# EAGLE design Adafruit DRV8833 (EAGLE 6.6.0)
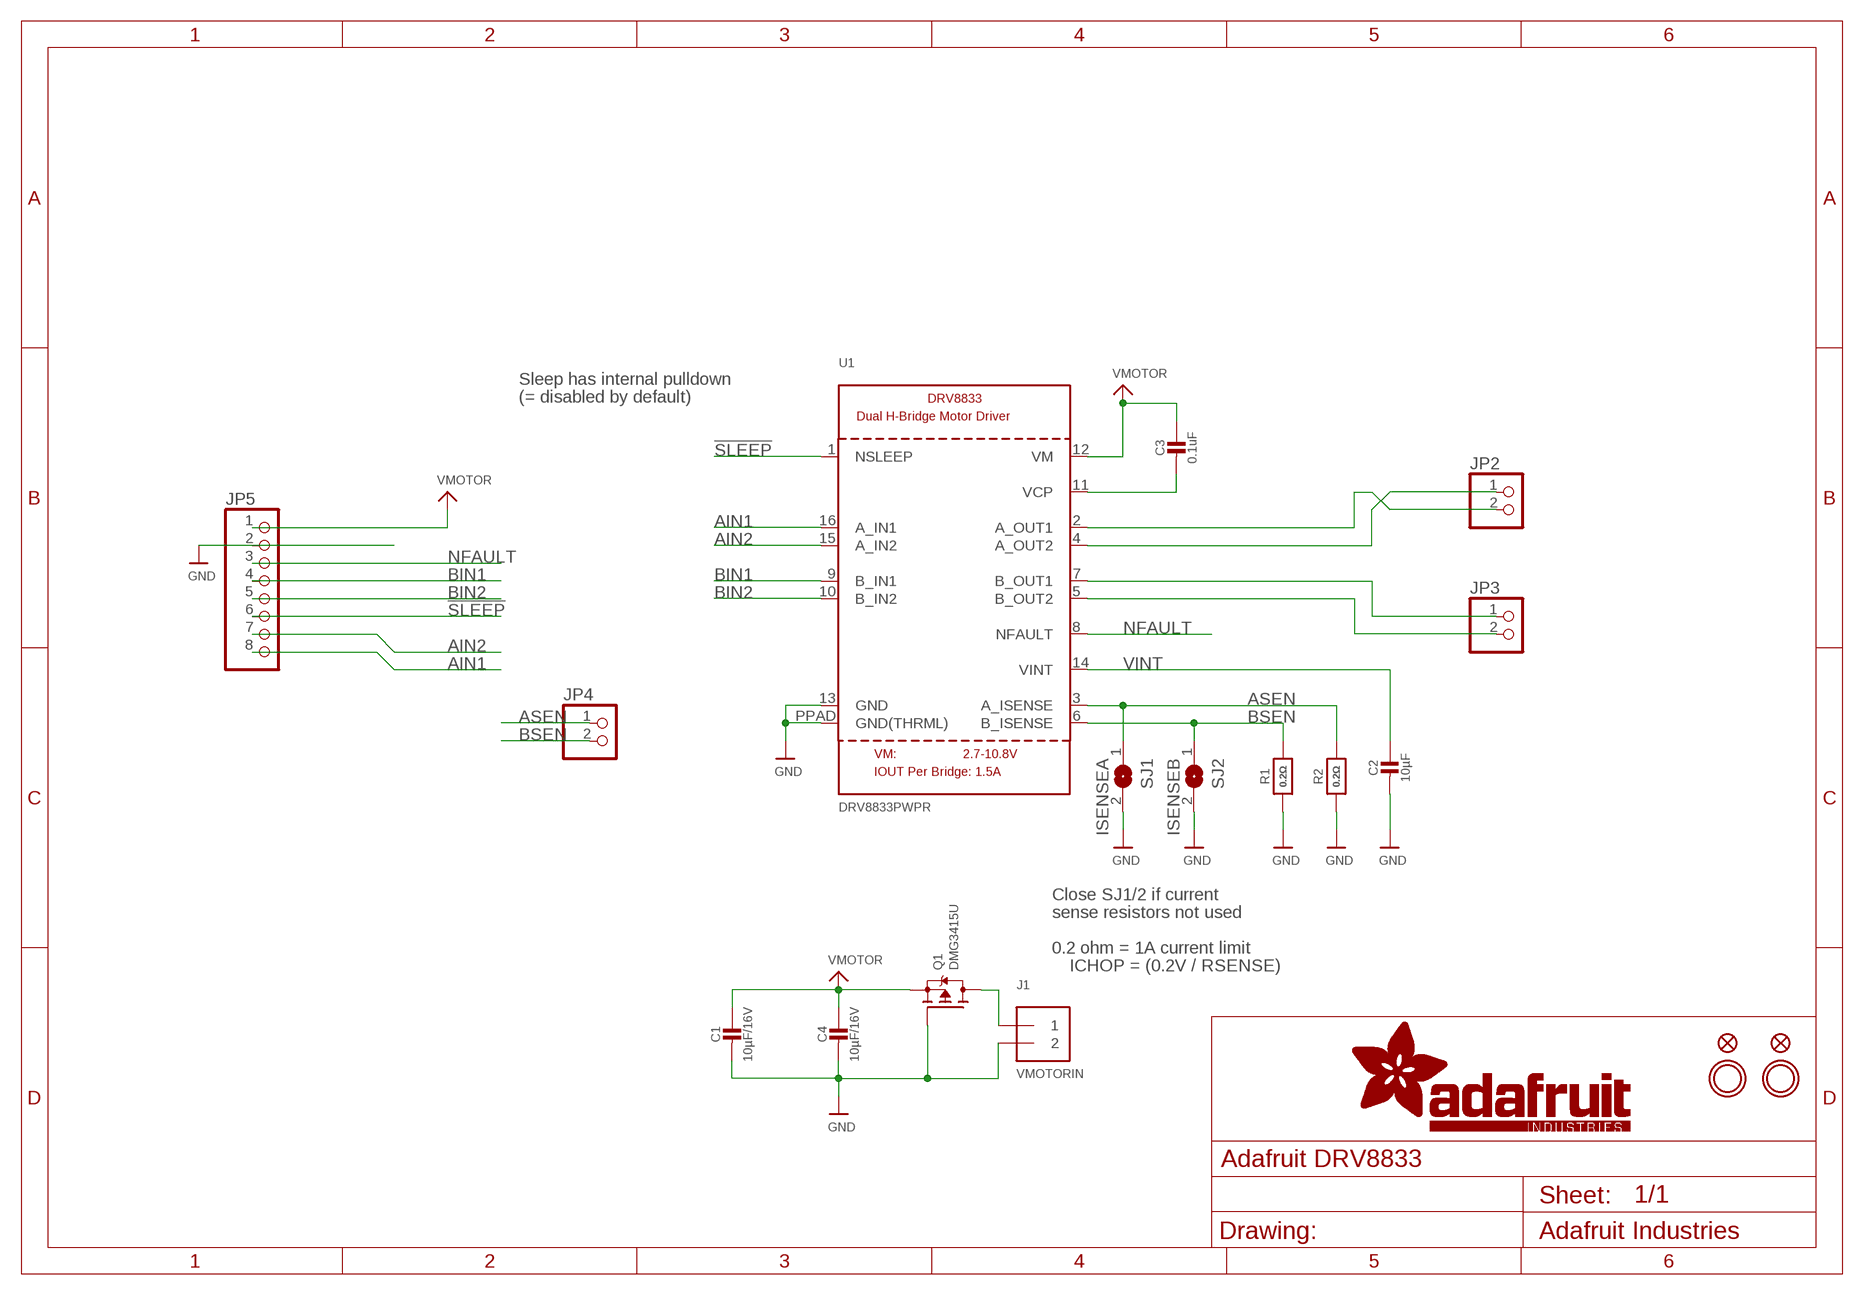
[diagram p0: schematic, sheet 1]

## Parts
C1  10µF/16V  CAP_CERAMIC0805-NOOUTLINE  [0805-NO]
C2  10µF  CAP_CERAMIC0805-NOOUTLINE  [0805-NO]
C3  0.1uF  CAP_CERAMIC0805-NOOUTLINE  [0805-NO]
C4  10µF/16V  CAP_CERAMIC0805-NOOUTLINE  [0805-NO]
FID1  FIDUCIAL""  [FIDUCIAL_1MM]
FID2  FIDUCIAL""  [FIDUCIAL_1MM]
J1  VMOTORIN  TERMBLOCK_1X2  [TERMBLOCK_1X2-3.5MM]
JP2  HEADER-1X2ROUND  [1X02_ROUND]
JP3  HEADER-1X2ROUND  [1X02_ROUND]
JP4  HEADER-1X2ROUND  [1X02_ROUND]
JP5  HEADER-1X870MIL  [1X08_ROUND_70]
Q1  DMG3415U  MOSFET-PWIDE  [SOT23-WIDE]
R1  0.2Ω  RESISTOR_1206  [_1206]
R2  0.2Ω  RESISTOR_1206  [_1206]
SJ1  ISENSEA  SOLDERJUMPER  [SOLDERJUMPER_ARROW_NOPASTE]
SJ2  ISENSEB  SOLDERJUMPER  [SOLDERJUMPER_ARROW_NOPASTE]
U1  DRV8833PWPR  DRV8833  [HTSSOP16]
U$13  MOUNTINGHOLE2.5  [MOUNTINGHOLE_2.5_PLATED]
U$14  MOUNTINGHOLE2.5  [MOUNTINGHOLE_2.5_PLATED]

## Nets
!SLEEP: JP5.6 U1.1(NSLEEP)
AIN1: JP5.8 U1.16(A_IN1)
AIN2: JP5.7 U1.15(A_IN2)
AOUT1: JP2.2 U1.2(A_OUT1)
AOUT2: JP2.1 U1.4(A_OUT2)
ASEN: JP4.1 R2.2 SJ1.1 U1.3(A_ISENSE)
BIN1: JP5.4 U1.9(B_IN1)
BIN2: JP5.5 U1.10(B_IN2)
BOUT1: JP3.1 U1.7(B_OUT1)
BOUT2: JP3.2 U1.5(B_OUT2)
BSEN: JP4.2 R1.2 SJ2.1 U1.6(B_ISENSE)
GND: C1.2 C2.2 C4.2 J1.2 JP5.2 Q1.1(G) R1.1 R2.1 SJ1.2 SJ2.2 U1.13(GND) U1.PPAD(GND(THRML))
N$8: C3.2 U1.11(VCP)
NFAULT: JP5.3 U1.8(NFAULT)
PWRIN: J1.1 Q1.3(D)
VINT: C2.1 U1.14(VINT)
VMOTOR: C1.1 C3.1 C4.1 JP5.1 Q1.2(S) U1.12(VM)

## Notes on the sheet
- Sleep has internal pulldown
- (= disabled by default)
- Close SJ1/2 if current
- sense resistors not used
- 0.2 ohm = 1A current limit
- ICHOP = (0.2V / RSENSE)

## Library data of the parts
C1-C4 = microbuilder:CAP_CERAMIC: Ceramic Capacitors For new designs, use the packages preceded by an '_' character since they are more reliable: The following footprints should be used on most boards: _0402 - Standard footprint for regular board layouts _0603 - Standard footprint for regular board layouts _0805 - Standard footprint for regular board layouts _1206 - Standard footprint for regular board layouts For extremely tight-pitch boards where space is at a premium, the following 'micro-pitch' footprints can be used (smaller pads, no silkscreen outline, etc.): _0402MP - Micro-pitch footprint for very dense/compact boards _0603MP - Micro-pitch footprint for very dense/compact boards _0805MP - Micro-pitch footprint for very dense/compact boards _1206MP - Micro-pitch footprint for very dense/compact boards
FID1 FID2 = microbuilder:FIDUCIAL: Fiducial Alignment Points Various fiducial points for machine vision alignment.; BOM: EXCLUDE
J1 = microbuilder:TERMBLOCK_1X2: 3.5mm Terminal block http://www.ladyada.net/library/pcb/eaglelibrary.html
JP2-JP4 = microbuilder:HEADER-1X2: PIN HEADER
JP5 = microbuilder:HEADER-1X8: PIN HEADER
Q1 = microbuilder:MOSFET-P: P-Channel Mosfet LEGEND VDS: Voltage Drain-Source ID: Drain Current RDS(ON): Drain-Source On-State Resistance VGS(TH): Gate-Source Threshold Voltage CISS: Drain-Source Input Capacitance SOT-23 Name VDS ID RDS(ON) VGS(TH) CISS Order Number IRLML5103 30V 760mA 600 mOhm -- 75pF @ 25V Digikey: IRLML5103PBFCT-ND IRLML6401 12V 4.3A 50 mOhm 950mV @ 250µA 830pF @ 10V Digikey: IRLML6401PBFTR-ND NTR0202PL 20V 400mA 800 mOhm 2.3V @ 250uA 70pF @ 5V Digikey: NTR0202PLT1GOSTR-ND NTR4101PT1G 20V 1.8A 85 mOhm 1.2V @ 250uA 675pF @ 10V Digikey: NTR4101PT1GOSCT-ND DMP2004K 20V 600mA 900 mOhm 1V @ 250uA 175pF @ 16V Digikey: DMP2004KDICT-ND PMV65XP 20V 3.9A 76 mOhm 950mV @ 1mA 725pF @ 20V Digikey: 568-2358-2-ND TO-252 Name VDS ID RDS(ON) VGS(TH) CISS Order Number AOD417 30V 25A 34 mOhm 3V @ 250µA 920pF @ 15V Digikey: 785-1106-2-ND
R1 R2 = microbuilder:RESISTOR: Resistors For new designs, use the packages preceded by an '_' character since they are more reliable: The following footprints should be used on most boards: _0402 - Standard footprint for regular board layouts _0603 - Standard footprint for regular board layouts _0805 - Standard footprint for regular board layouts _1206 - Standard footprint for regular board layouts For extremely tight-pitch boards where space is at a premium, the following 'micro-pitch' footprints can be used (smaller pads, no silkscreen outline, etc.): _0402MP - Micro-pitch footprint for very dense/compact boards _0603MP - Micro-pitch footprint for very dense/compact boards _0805MP - Micro-pitch footprint for very dense/compact boards _1206MP - Micro-pitch footprint for very dense/compact boards
SJ1 SJ2 = microbuilder:SOLDERJUMPER: SMD Solder JUMPER Solder the two pads together to create a connection, or remove the solder to break it. REFLOW - Use this footprint for solder paste and reflow ovens. WAVE - Use this footprint for hand-soldering (larger pads). CLOSED - Has a trace between the two pads to ensure it is closed by default. The trace needs to be cut to disable the jumper, and can be closed again by creating a solder bridge between the two pads.; BOM: EXCLUDE
U1 = microbuilder:DRV8833: DRV8833 Dual H-Bridge Motor Driver -- HTSSOP Package
U$13 U$14 = microbuilder:MOUNTINGHOLE: Mounting Hole For #2 screws (0.086"/2.18mm width, 0.094"/2.4mm hole) use 2.5mm; BOM: EXCLUDE

## Board
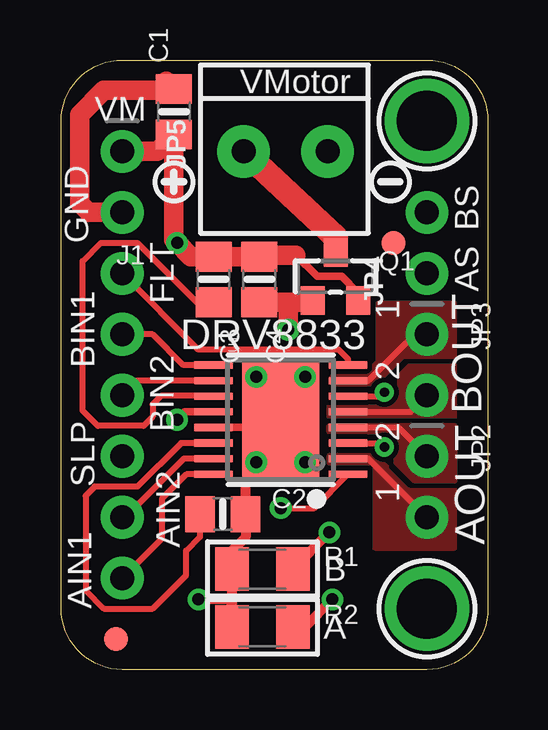
[diagram p1: board, top side]
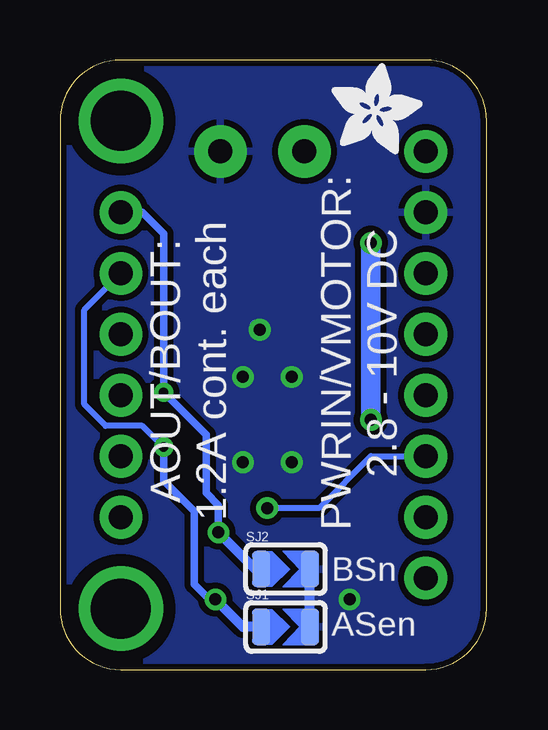
[diagram p2: board, bottom side, seen from below]

Size 17.78 x 25.4 mm. Coordinates in mm from the lower left corner, seen from the top.
Outline: 2.54,25.4 15.24,25.4 arc-90 17.78,22.86 17.78,2.54 arc-90 15.24,0 2.54,0 arc-90 0,2.54 0,22.86 arc-90 2.54,25.4
Copper layers (1*16): Top 0.035mm / dielectric 1.5mm / Bottom 0.035mm
Design rules "adafruit *": minimum track width 8mil, minimum drill 15.5mil, track to track 8mil, track to pad 8mil, pad to pad 8mil, via to via 8mil, smd to smd 8mil, copper to edge 10mil, drill to drill 8mil, minimum pad ring 10mil, minimum via ring 8mil, stop-mask expansion 2mil, vias tented up to drill 20mil, thermal gap 10mil

### Footprints (pad centres in the part's own frame; a part is rotated, then mirrored left to right if it is on the bottom)
0805-NO = smd 1.24 x 1.5: 1 -0.95,0; 2 0.95,0
FIDUCIAL_1MM = smd 1 x 1: 1 0,0
TERMBLOCK_1X2-3.5MM = drill 1 pad 2.184: 1 1.8,0; 2 -1.7,0
1X02_ROUND = drill 1 pad 1.778: 1 -1.27,0; 2 1.27,0
1X08_ROUND_70 = drill 1 pad 1.778: 1 -8.89,0; 2 -6.35,0; 3 -3.81,0; 4 -1.27,0; 5 1.27,0; 6 3.81,0; 7 6.35,0; 8 8.89,0
SOT23-WIDE = smd 1 x 1.2: 1 -0.95,-1; 2 0.95,-1; 3 0,1
_1206 = smd 1.4 x 1.8: 1 -1.27,0; 2 1.27,0
SOLDERJUMPER_ARROW_NOPASTE = smd 0.762 x 1.524: 1 -1.016,0; 2 1.016,0
HTSSOP16 = smd 0.3 x 1.6: 1 -2.275,-2.8; 2 -1.625,-2.8; 3 -0.975,-2.8; 4 -0.325,-2.8; 5 0.325,-2.8; 6 0.975,-2.8; 7 1.625,-2.8; 8 2.275,-2.8; 9 2.275,2.8; 10 1.625,2.8; 11 0.975,2.8; 12 0.325,2.8; 13 -0.325,2.8; 14 -0.975,2.8; 15 -1.625,2.8; 16 -2.275,2.8 | smd 4.8 x 3.2: PPAD 0,0
MOUNTINGHOLE_2.5_PLATED = drill 2.5 pad 3.2: P$1 0,0

### Placement (x,y rotation side)
C1  4.7,23.24 90 top
C2  6.73,6.48 0 top
C3  6.35,16.26 270 top
C4  8.26,16.26 270 top
FID1  13.84,17.78 0 top
FID2  2.29,1.27 0 top
J1  9.4,21.59 180 top
JP2  15.24,7.62 270 top
JP3  15.24,12.7 270 top
JP4  15.24,17.78 90 top
JP5  2.54,12.7 270 top
Q1  11.43,16.38 0 top
R1  8.38,4.19 0 top
R2  8.38,1.78 0 top
SJ1  8.38,1.78 0 bottom
SJ2  8.38,4.19 0 bottom
U1  9.14,10.41 90 top
U$13  15.24,22.86 0 top
U$14  15.24,2.54 0 top
U$15  [SYMBOL_PLUS]  4.7,20.32 0 top
U$16  [SYMBOL_MINUS]  13.72,20.32 0 top
U$17  [ADAFRUIT_3.5MM]  6.48,21.46 0 bottom

### Tracks (layer width: path | path; a pad name or v marks a point on that pad's centre or on a via)
!SLEEP  (via drill 0.5)
  Top 0.254: v9.14,6.73 10.54,6.73 U1.1
  Bottom 0.254: v9.14,6.73 6.98,6.73 4.83,8.89 JP5.6
AIN1
  Top 0.254: U1.16 5.22,8.14 4.19,7.11 4.19,5.46 JP5.8
AIN2
  Top 0.254: U1.15 5.11,8.79 2.67,6.35 JP5.7
AOUT1
  Top 0.254: U1.2 12.8,8.79 JP2.2
  pour Top (rank 2, no thermals): 11.18,8.89 11.18,8.64 13.08,8.64 13.08,5.08 16.38,5.08 16.38,7.62 14.61,7.62 12.95,8.89
AOUT2
  Top 0.254: U1.4 14.04,10.09 JP2.1
  pour Top (no thermals): 11.18,10.16 16.38,10.16 16.38,7.87 14.73,7.87 13.97,8.64 13.97,9.78 13.84,9.91 11.18,9.91
ASEN  (via drill 0.39, 0.5)
  Top 0.254: U1.3 13.29,9.44 v13.46,9.27
  Top 0.406: R2.2 10.16,1.78 v11.3,2.92
  Bottom 0.254: JP4.1 16.76,14.99 16.76,11.05 15.88,10.16 14.35,10.16 v13.46,9.27 | 11.56,2.92 v11.3,2.92
  Bottom 0.305: v13.46,9.27 13.46,7.87 12.19,6.6 12.19,3.56 11.56,2.92
  Bottom 0.406: SJ1.1 10.16,1.78 v11.3,2.92
BIN1
  Top 0.254: U1.9 5.09,12.69 3.81,13.97 JP5.4
BIN2
  Top 0.254: U1.10 3.15,12.04 JP5.5
BOUT1
  Top 0.254: U1.7 12.8,12.04 14.73,13.97 JP3.1
  pour Top (no thermals): 11.3,11.94 13.08,11.94 14.22,13.08 16.38,13.08 16.38,15.24 13.21,15.24 13.21,12.83 12.57,12.19 11.3,12.19
BOUT2
  Top 0.254: U1.5 14.55,10.74 JP3.2
  pour Top (rank 2, no thermals): 11.18,10.54 16.38,10.54 16.38,12.7 14.48,12.7 14.1,12.32 14.1,11.3 13.84,11.05 11.18,11.05
BSEN  (via drill 0.39, 0.5)
  Top 0.254: U1.6 13.29,11.39 v13.46,11.56
  Top 0.406: R1.2 v11.18,5.71
  Bottom 0.305: JP4.2 14.35,19.05 13.46,18.16 v13.46,11.56 11.68,9.78 11.68,7.37 11.18,6.86 v11.18,5.71
  Bottom 0.406: SJ2.1 R1.2 v11.18,5.71
GND  (via drill 0.5)
  Top 0.305: U1.13 8.51,10.09 8.82,10.09 arc90 U1.PPAD
  Top 0.406: 8.38,8.51 7.68,7.81 C2.2 7.68,5.52 7.11,4.95 R1.1 R2.1 7.11,2.92 v5.71,2.92 | 8.38,8.51 8.38,9.96 8.51,10.09 | 8.38,8.51 8.89,9.02
  Top 0.813: 4.38,24.51 C1.2 4.64,24.13 1.78,24.13 0.76,23.11 0.76,19.43 1.14,19.05 JP5.2 | C4.2 9.46,15.31 | Q1.1 arc-45 10.29,15.31 9.46,15.31 | 9.46,15.31 v9.46,14.16
  Bottom 0.406: v9.46,14.16 9.65,14.35 | SJ1.2 SJ2.2
  other vias: 8.13,12.19 10.16,8.64 8.13,8.64 10.16,12.19
  pour Bottom (isolate 0.254): 0,0 0,25.4 17.78,25.4 17.78,0
N$8
  Top 0.254: C3.2 5.65,15.31 3.17,17.78 1.65,17.78 0.89,17.02 0.89,10.79 1.52,10.16 3.43,10.16 3.81,10.54 3.81,11.05 4.19,11.43 6.3,11.43 U1.11
NFAULT
  Top 0.254: U1.8 11.94,12.95 11.56,13.33 5.71,13.33 JP5.3
PWRIN
  Top 1.016: J1.1 11.43,18.01 Q1.3
VINT
  Top 0.254: C2.1 5.78,5.53 5.21,4.95 5.21,3.94 3.81,2.54 1.78,2.54 1.02,3.3 1.02,7.24 1.4,7.62 3.17,7.62 4.99,9.44 U1.14
VMOTOR  (via drill 0.5)
  Top 0.305: U1.12 5.15,10.74 v4.83,10.41 | 9.78,17.27 10.67,16.38 11.68,16.38 12.38,15.69
  Top 0.406: 12.38,15.69 Q1.2
  Top 0.813: 9.78,17.27 8.32,17.27 C4.1 C3.1 5.4,17.21 v4.83,17.78 4.7,17.91 C1.1 4,21.59 JP5.1
  Bottom 0.813: v4.83,10.41 v4.83,17.78

### Text on the board
tPlace: VMotor | VM | GND | BS | FLT | AS | 1 | DRV8833 | BIN1 | 2 | BIN2 | BOUT | 2 | SLP | 1 | AIN2 | AOUT | B | AIN1 | A
bPlace: PWRIN/VMOTOR: / 2.8 - 10V DC | AOUT/BOUT: / 1.2A cont. each | BSn | ASen